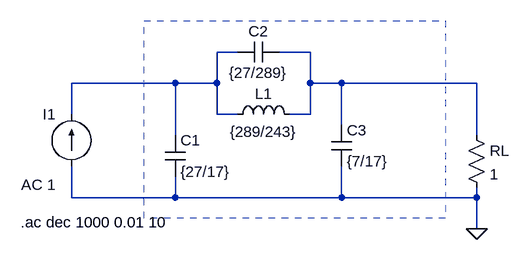
[diagram p0: schematic sim2.asc]
sim2.asc, the LTspice schematic file:
Version 4
SHEET 1 880 680
WIRE -48 96 -80 96
WIRE 64 96 16 96
WIRE -144 144 -304 144
WIRE -80 144 -80 96
WIRE -80 144 -144 144
WIRE 64 144 64 96
WIRE 112 144 64 144
WIRE 320 144 112 144
WIRE -304 192 -304 144
WIRE -80 192 -80 144
WIRE -48 192 -80 192
WIRE 64 192 64 144
WIRE 64 192 32 192
WIRE 112 208 112 144
WIRE -144 224 -144 144
WIRE 320 224 320 144
WIRE -304 320 -304 272
WIRE -144 320 -144 288
WIRE -144 320 -304 320
WIRE 112 320 112 272
WIRE 112 320 -144 320
WIRE 320 320 320 304
WIRE 320 320 112 320
WIRE 320 368 320 320
FLAG 320 368 0
SYMBOL res 304 208 R0
SYMATTR InstName RL
SYMATTR Value 1
SYMBOL current -304 272 R180
WINDOW 0 24 80 Left 2
WINDOW 3 24 0 Left 2
WINDOW 123 24 -28 Left 2
WINDOW 39 0 0 Left 0
SYMATTR InstName I1
SYMATTR Value ""
SYMATTR Value2 AC 1
SYMBOL cap -160 224 R0
SYMATTR InstName C1
SYMATTR Value {27/17}
SYMBOL cap 16 80 R90
WINDOW 0 0 32 VBottom 2
WINDOW 3 32 32 VTop 2
SYMATTR InstName C2
SYMATTR Value {27/289}
SYMBOL ind -64 208 R270
WINDOW 0 32 56 VTop 2
WINDOW 3 5 56 VBottom 2
SYMATTR InstName L1
SYMATTR Value {289/243}
SYMBOL cap 96 208 R0
SYMATTR InstName C3
SYMATTR Value {7/17}
TEXT -382 358 Left 2 !.ac dec 1000 0.01 10
RECTANGLE Normal 272 352 -192 48 2

The netlist it stands for:
* sim2.asc
RL N002 0 1
I1 0 N001 AC 1
C1 N001 0 {27/17}
C2 N002 N001 {27/289}
L1 N001 N002 {289/243}
C3 N002 0 {7/17}
.ac dec 1000 0.01 10
.backanno
.end